# Altium schematic sheet Peripherals.SchDoc
size A4
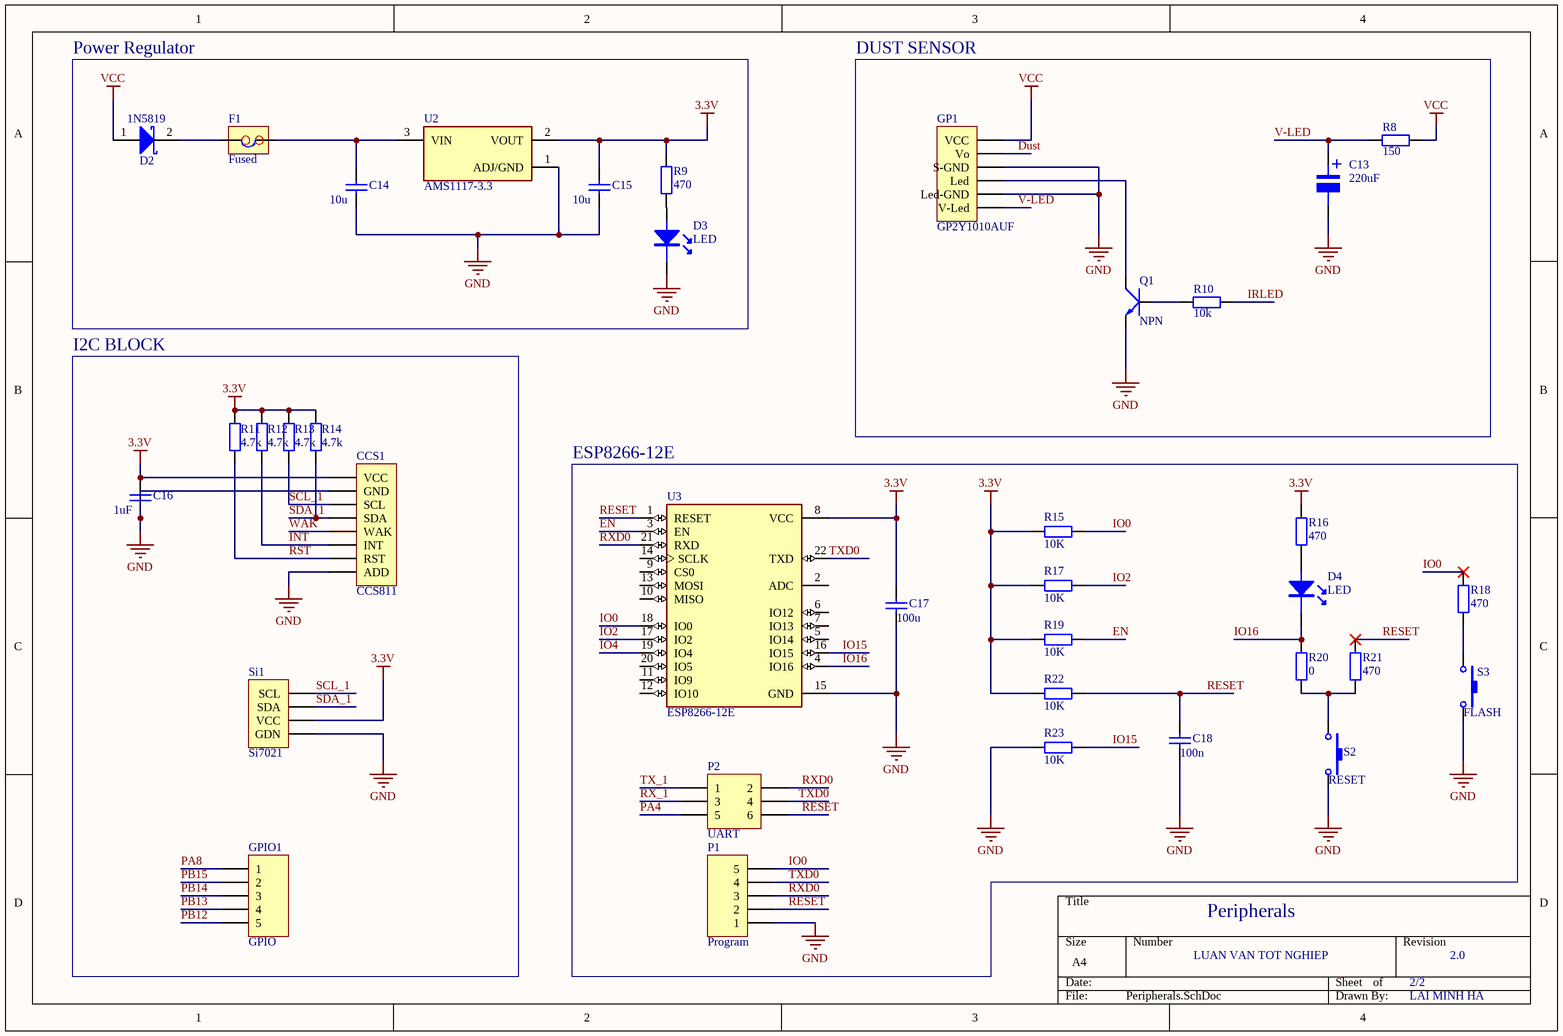
[diagram p0: Peripherals.SchDoc]

## Parts
C13  220uF  [tu nhom 8 (e)]
C14  10u  [C0805]
C15  10u  [C0805]
C16  1uF  [C0805]
C17  100u  [C0805]
C18  100n  [C0805]
CCS1  CCS811  [HDR1X8]
D2  1N5819  [SOD123]
D3  LED  [LED 0805]
D4  LED  [LED 0805]
F1  Fused  [HDR1X2H]
FLASH  S3  [SW-SMD]
GP1  GP2Y1010AUF  [HDR1X6]
GPIO1  GPIO  [HDR1X5]
P1  Program  [HDR1X5H]
P2  UART  [HDR2X3]
Q1  NPN  [SOT23-231]
R8  value 150  [DIEN TRO 0805]  (hidden comment: R0805)
R9  470  [tro smd 0805]
R10  value 10k  [DIEN TRO 0805]  (hidden comment: R0805)
R11  value 4.7k  [DIEN TRO 0805]  (hidden comment: R0805)
R12  value 4.7k  [DIEN TRO 0805]  (hidden comment: R0805)
R13  value 4.7k  [DIEN TRO 0805]  (hidden comment: R0805)
R14  value 4.7k  [DIEN TRO 0805]  (hidden comment: R0805)
R15  10K  [tro smd 0805]
R16  470  [tro smd 0805]
R17  10K  [tro smd 0805]
R18  470  [tro smd 0805]
R19  10K  [tro smd 0805]
R20  0  [tro smd 0805]
R21  470  [tro smd 0805]
R22  10K  [tro smd 0805]
R23  10K  [tro smd 0805]
S2  RESET  [SW-SMD]
Si1  Si7021  [Header 4]
U2  AMS1117-3.3  [SOT-223]
U3  ESP8266-12E  [XCVR_ESP8266-12E/ESP-12E]

## Nets
3.3V: C15.2 C16.2 C17.2 CCS1.1(VCC) R9.2 R11.1 R12.1 R13.1 R14.1 R15.1 R16.2 R17.1 R19.1 R22.1 Si1.2(VCC) U2.2(VOUT) U3.8(VCC)
GND: C13.2 C14.1 C15.1 C16.1 C17.1 C18.1 CCS1.2(GND) CCS1.8(ADD) D3.2 FLASH.2 GP1.2(Led-GND) GP1.4(S-GND) P1.1 Q1.1(E) R23.1 S2.2 Si1.1(GDN) U2.1(ADJ/GND) U3.15(GND)
VCC: D2.1(A) GP1.6(VCC) R8.1
Dust: GP1.5(Vo)
EN: R19.2 U3.3(EN)
INT: CCS1.6(INT) R12.2
IO0: P1.5 R15.2 R18.2 U3.18(IO0)
IO2: R17.2 U3.17(IO2)
IO4: U3.19(IO4)
IO15: R23.2 U3.16(IO15)
IO16: D4.2 R20.2 U3.4(IO16)
IRLED: R10.1
PA4: P2.5
PA8: GPIO1.1
PB12: GPIO1.5
PB13: GPIO1.4
PB14: GPIO1.3
PB15: GPIO1.2
RESET: C18.2 P1.2 P2.6 R21.2 R22.2 U3.1(RESET)
RST: CCS1.7(RST) R11.2
RX_1: P2.3
RXD0: P1.3 P2.2 U3.21(RXD)
SCL_1: CCS1.3(SCL) R13.2 Si1.4(SCL)
SDA_1: CCS1.4(SDA) R14.2 Si1.3(SDA)
TX_1: P2.1
TXD0: P1.4 P2.4 U3.22(TXD)
V-LED: C13.1 GP1.1(V-Led) R8.2
WAK: CCS1.5(WAK)
NetC14_2: C14.2 F1.2 U2.3(VIN)
NetD2_2: D2.2 F1.1
NetD3_1: D3.1 R9.1
NetD4_1: D4.1 R16.1
NetFLASH_1: FLASH.1 R18.1
NetGP1_3: GP1.3(Led) Q1.3(C)
NetQ1_2: Q1.2(B) R10.2
NetR20_1: R20.1 R21.1 S2.1

Not connected (* = marked no-connect by the designer): U3 2(ADC) 5(IO14) 6(IO12) 7(IO13) 9(CS0) 10(MISO) 11(IO9) 12(IO10) 13(MOSI) 14(SCLK) 20(IO5)

## Notes on the sheet
- Power Regulator
- DUST SENSOR
- I2C BLOCK
- ESP8266-12E
- Peripherals
- LUAN VAN TOT NGHIEP
- 2/2
- 2.0
- LAI MINH HA
- (in symbol Tu Nhom 220uF 10V) +

## Library data of the parts
C13 = Tu Nhom 220uF 10V: Dán; So_Chan: 2; Ten_Linh_Kien: Tụ Nhôm 220uF 10V; Ma_Hang: MH004021; Don_Vi: Con; Chung_Loai: Dán; Kieu_Chan: *
C14-C16 = CapSMD: Capacitor; Value: 33p; Published: 8-Jun-2000; LatestRevisionDate: 17-Jul-2002; LatestRevisionNote: Re-released for DXP Platform.; PackageReference: RAD-0.3; Publisher: Altium Limited
C17 = CapSMD: 100n; Value: 33p; Published: 8-Jun-2000; LatestRevisionDate: 17-Jul-2002; LatestRevisionNote: Re-released for DXP Platform.; PackageReference: RAD-0.3; Publisher: Altium Limited
C18 = CapSMD: Value: 33p; Published: 8-Jun-2000; LatestRevisionDate: 17-Jul-2002; LatestRevisionNote: Re-released for DXP Platform.; PackageReference: RAD-0.3; Publisher: Altium Limited
CCS1 = Header 8: Header, 8-Pin; LatestRevisionDate: 17-Jul-2002; LatestRevisionNote: Re-released for DXP Platform.; Publisher: Altium Limited
D2 = Diode Schottky
F1 = FuseNote2
FLASH S2 = SW-SMD: Switch; Published: 24-Mar-1999; LatestRevisionDate: 17-Jul-2002; LatestRevisionNote: Re-released for DXP Platform.; PackageReference: SPST-2; Publisher: Altium Limited
GP1 = Header 6: Header, 6-Pin; LatestRevisionDate: 17-Jul-2002; LatestRevisionNote: Re-released for DXP Platform.; Publisher: Altium Limited
GPIO1 = Header 5: Header, 5-Pin; LatestRevisionDate: 17-Jul-2002; LatestRevisionNote: Re-released for DXP Platform.; Publisher: Altium Limited
P1 = Header 5H: Header, 5-Pin, Right Angle; LatestRevisionDate: 17-Jul-2002; LatestRevisionNote: Re-released for DXP Platform.; Publisher: Altium Limited
P2 = Header 3X2: Header, 3-Pin, Dual row; LatestRevisionDate: 17-Jul-2002; LatestRevisionNote: Re-released for DXP Platform.; Publisher: Altium Limited
Q1 = 2N222: NPN 600mW, ECB; Value: C1815
R8 R10-R14 = R0805: Resistor SMD 0805; Published: 8-Jun-2000; LatestRevisionDate: 17-Jul-2002; LatestRevisionNote: Re-released for DXP Platform.; PackageReference: AXIAL-0.4; Publisher: Altium Limited
R9 R15-R23 = Tro 0805 1% 82k: Dán; Don_Vi: Con; So_Chan: 2; Ten_Linh_Kien: Trở 0805 1% 82k; Ma_Hang: MH005482; Chung_Loai: Dán; Kieu_Chan: *
Si1 = Header 4: Header, 4-Pin; LatestRevisionDate: 17-Jul-2002; LatestRevisionNote: Re-released for DXP Platform.; Publisher: Altium Limited
U2 = AMS1117-3.3: Sot223/Pkg 1-Amp 3.3-Volt Low Drop Out Voltage Regulatator; MF: Advanced Monolithic Systems; Price: None; Package: None; Value: *; MP: AMS1117-3.3; Availability: Unavailable; SnapEDA_Link: https://www.snapeda.com/parts/AMS1117-3.3/Advanced%20Monolithic%20Systems/view-part/53450/?ref=snap
U3 = ESP8266-12E/ESP-12E: This WiFi module has a 32-bit MCU micro and clock speeds supporting 80 MHz or 160 MHz. Supports the RTOS and integrated Wi-Fi MAC/BB/RF/PA/LNA, and has an on-board antenna.; MF: AI-Thinker; Price: None; Package: None; Value: *; MP: ESP8266-12E/ESP-12E; Availability: Unavailable; SnapEDA_Link: https://www.snapeda.com/parts/ESP8266-12E/ESP-12E/AI-Thinker/view-part/106414/?ref=snap